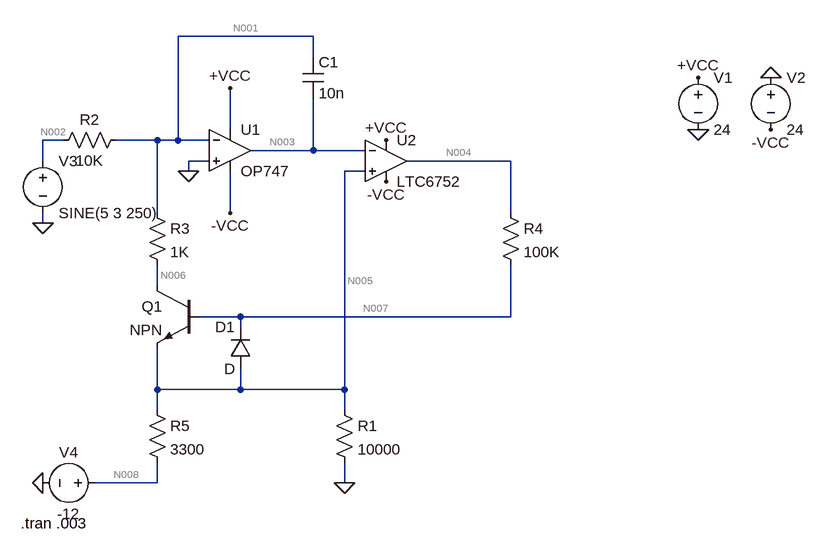
[diagram p0: schematic ej6tp4 VCO ONDA CUADRADA.asc]
ej6tp4 VCO ONDA CUADRADA.asc, the LTspice schematic file:
Version 4
SHEET 1 900 832
WIRE 144 64 -64 64
WIRE 144 96 144 64
WIRE 16 208 16 144
WIRE -240 224 -272 224
WIRE -96 224 -160 224
WIRE -64 224 -64 64
WIRE -64 224 -96 224
WIRE -16 224 -64 224
WIRE 144 240 144 160
WIRE 144 240 48 240
WIRE 224 240 144 240
WIRE -272 256 -272 224
WIRE -16 256 -48 256
WIRE 448 256 288 256
WIRE -48 272 -48 256
WIRE 224 272 192 272
WIRE -96 336 -96 224
WIRE 16 336 16 272
WIRE 448 336 448 256
WIRE -272 352 -272 336
WIRE -96 448 -96 416
WIRE 32 496 -32 496
WIRE 448 496 448 416
WIRE 448 496 32 496
WIRE 32 512 32 496
WIRE -96 608 -96 544
WIRE 32 608 32 576
WIRE 32 608 -96 608
WIRE 192 608 192 272
WIRE 192 608 32 608
WIRE -96 640 -96 608
WIRE 192 640 192 608
WIRE -96 752 -96 720
WIRE -96 752 -192 752
WIRE 192 752 192 720
FLAG 16 336 -VCC
FLAG 256 288 -VCC
FLAG 256 224 +VCC
FLAG 16 144 +VCC
FLAG 736 208 0
FLAG 848 128 0
FLAG 848 208 -VCC
FLAG 736 128 +VCC
FLAG -272 352 0
FLAG -48 272 0
FLAG 192 752 0
FLAG -272 752 0
SYMBOL Opamps\\OP747 16 176 R0
SYMATTR InstName U1
SYMBOL Comparators\\LTC6752 256 192 R0
SYMATTR InstName U2
SYMBOL voltage 736 112 R0
SYMATTR InstName V1
SYMATTR Value 24
SYMBOL voltage 848 112 R0
SYMATTR InstName V2
SYMATTR Value 24
SYMBOL voltage -272 240 R0
WINDOW 123 0 0 Left 0
WINDOW 39 0 0 Left 0
SYMATTR InstName V3
SYMATTR Value SINE(5 3 250)
SYMBOL res -144 208 R90
WINDOW 0 0 56 VBottom 2
WINDOW 3 32 56 VTop 2
SYMATTR InstName R2
SYMATTR Value 10K
SYMBOL res -112 320 R0
SYMATTR InstName R3
SYMATTR Value 1K
SYMBOL npn -32 448 M0
SYMATTR InstName Q1
SYMBOL diode 48 576 R180
WINDOW 0 24 64 Left 2
WINDOW 3 24 0 Left 2
SYMATTR InstName D1
SYMBOL res 432 320 R0
SYMATTR InstName R4
SYMATTR Value 100K
SYMBOL res 176 624 R0
SYMATTR InstName R1
SYMATTR Value 10000
SYMBOL res -112 624 R0
SYMATTR InstName R5
SYMATTR Value 3300
SYMBOL cap 128 96 R0
SYMATTR InstName C1
SYMATTR Value 10n
SYMBOL voltage -176 752 R90
WINDOW 0 -32 56 VBottom 2
WINDOW 3 32 56 VTop 2
SYMATTR InstName V4
SYMATTR Value -12
TEXT -306 814 Left 2 !.tran .003

The netlist it stands for:
* ej6tp4 VCO ONDA CUADRADA.asc
XU1 0 N001 +VCC -VCC N003 OP747  ; pins In+ In- V+ V- OUT
XU2 N005 N003 +VCC -VCC N004 LTC6752  ; pins In+ In- V+ V- OUT
V1 +VCC 0 24
V2 0 -VCC 24
V3 N002 0 SINE(5 3 250)
R2 N001 N002 10K
R3 N001 N006 1K
Q1 N006 N007 N005 0 NPN
D1 N005 N007 D
R4 N004 N007 100K
R1 N005 0 10000
R5 N005 N008 3300
C1 N001 N003 10n
V4 N008 0 -12
.model D D
.lib standard.dio
.model NPN NPN
.model PNP PNP
.lib standard.bjt
.tran .003
.lib LTC7.lib
.backanno
.end

* Results of the author's LTspice run, read from the files saved beside the schematic
* Operating Point, zero values left out:
*   V(n001) = 80.34 µV
*   V(-vcc) = -24 V
*   V(+vcc) = 24 V
*   V(n003) = -7.762 V
*   V(n005) = -7.76 V
*   V(n004) = -6.503 V
*   V(n002) = 5 V
*   V(n006) = -499.9 mV
*   V(n007) = -7.003 V
*   V(n008) = -12 V
*   Ic(Q1) = 500 µA
*   Ib(Q1) = 5 µA
*   Ie(Q1) = -505 µA
*   I(R2) = -500 µA
*   I(R3) = 500 µA
*   I(R4) = 5 µA
*   I(R1) = -776 µA
*   I(R5) = 1.285 mA
*   I(V1) = -37.03 mA
*   I(V2) = -37.02 mA
*   I(V3) = -500 µA
*   I(V4) = 1.285 mA
*   Ix(u1:1) = -10.27 nA
*   Ix(u1:2) = -8.27 nA
*   Ix(u1:99) = 372.8 µA
*   Ix(u1:50) = -376.8 µA
*   Ix(u1:45) = 4.111 µA
*   Ix(u2:1) = -4.012 µA
*   Ix(u2:2) = -4.111 µA
*   Ix(u2:3) = 36.66 mA
*   Ix(u2:4) = -36.65 mA
*   Ix(u2:5) = -5 µA
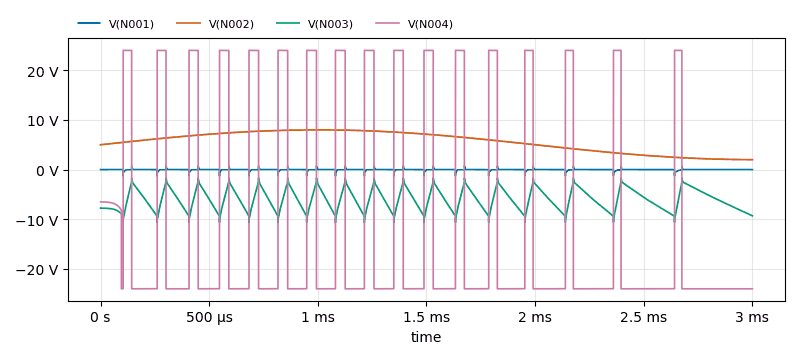
[diagram p1: Transient Analysis of ej6tp4 VCO ONDA CUADRADA.asc, plotted from the saved traces]
* Transient Analysis, 1 run:
*   V(N001): min -1.269 V, max 731.8 mV, average -13.28 mV, rms 124.5 mV, last 4.595 mV
*   V(N002): min 2 V, max 8 V, average 5.637 V, rms 5.989 V, last 2 V
*   V(N003): min -10.65 V, max -1.706 V, average -6.028 V, rms 6.508 V, last -9.3 V
*   V(N004): min -24 V, max 24 V, average -12.28 V, rms 23.64 V, last -24 V